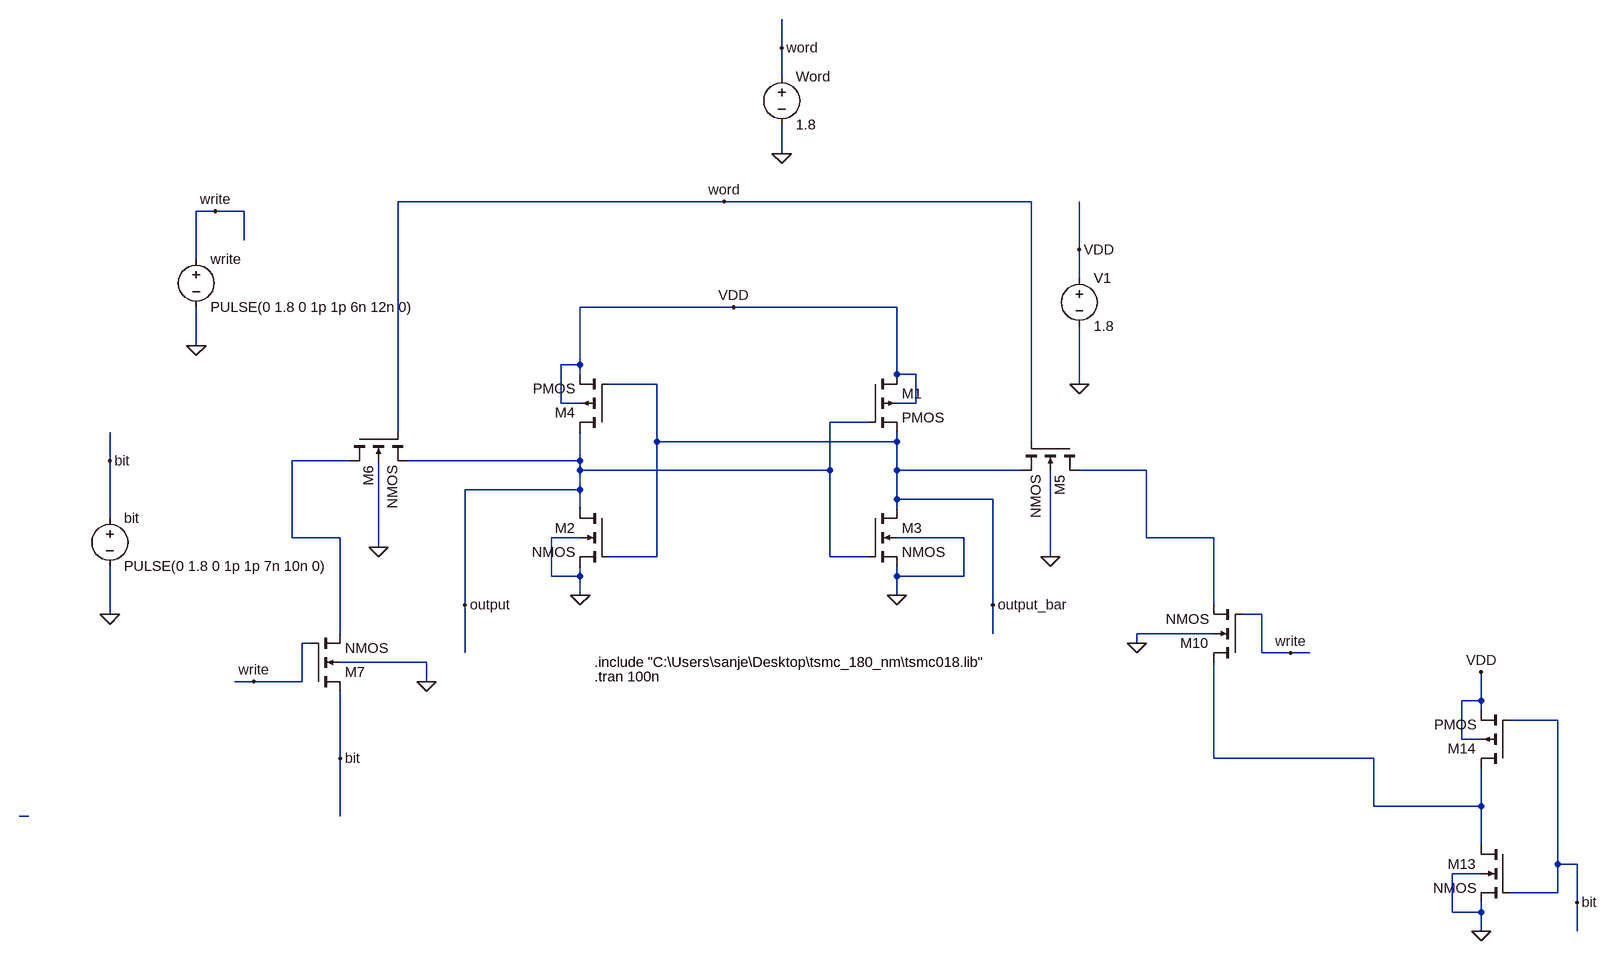
[diagram p0: schematic 6T -SRAM_write.asc]
6T -SRAM_write.asc, the LTspice schematic file:
Version 4.1
SHEET 1 1616 740
WIRE 144 -752 144 -800
WIRE 144 -704 144 -752
WIRE 144 -576 144 -624
WIRE 48 -496 -496 -496
WIRE 560 -496 48 -496
WIRE -800 -480 -832 -480
WIRE -752 -480 -800 -480
WIRE -752 -432 -752 -480
WIRE 640 -416 640 -496
WIRE -832 -400 -832 -480
WIRE 640 -368 640 -416
WIRE 64 -320 -192 -320
WIRE 336 -320 64 -320
WIRE -832 -256 -832 -320
WIRE -192 -224 -192 -320
WIRE -192 -224 -224 -224
WIRE -192 -208 -192 -224
WIRE 336 -208 336 -320
WIRE 368 -208 336 -208
WIRE -64 -192 -144 -192
WIRE 640 -192 640 -288
WIRE -224 -160 -224 -224
WIRE -192 -160 -224 -160
WIRE 368 -160 368 -208
WIRE 368 -160 336 -160
WIRE 288 -128 224 -128
WIRE -496 -112 -496 -496
WIRE -64 -96 -64 -192
WIRE 336 -96 336 -112
WIRE 336 -96 -64 -96
WIRE 560 -96 560 -496
WIRE -976 -64 -976 -112
WIRE -576 -64 -672 -64
WIRE -192 -64 -192 -112
WIRE -192 -64 -480 -64
WIRE -192 -48 -192 -64
WIRE 224 -48 224 -128
WIRE 224 -48 -192 -48
WIRE 336 -48 336 -96
WIRE 544 -48 336 -48
WIRE 752 -48 640 -48
WIRE -192 -16 -192 -48
WIRE -192 -16 -384 -16
WIRE 336 0 336 -48
WIRE 496 0 336 0
WIRE -192 16 -192 -16
WIRE 336 16 336 0
WIRE -976 32 -976 -64
WIRE -672 64 -672 -64
WIRE -592 64 -672 64
WIRE -192 64 -240 64
WIRE 448 64 336 64
WIRE 752 64 752 -48
WIRE 864 64 752 64
WIRE -528 80 -528 -64
WIRE -64 96 -64 -96
WIRE -64 96 -144 96
WIRE 224 96 224 -48
WIRE 288 96 224 96
WIRE 592 96 592 -48
WIRE -240 128 -240 64
WIRE -192 128 -192 112
WIRE -192 128 -240 128
WIRE 336 128 336 112
WIRE 448 128 448 64
WIRE 448 128 336 128
WIRE -192 160 -192 128
WIRE 336 160 336 128
WIRE -384 176 -384 -16
WIRE 496 176 496 0
WIRE 864 176 864 64
WIRE -976 192 -976 112
WIRE 944 192 912 192
WIRE -592 224 -592 64
WIRE 496 224 496 176
WIRE 864 224 736 224
WIRE -640 240 -656 240
WIRE 736 240 736 224
WIRE -384 256 -384 176
WIRE 944 256 944 192
WIRE 992 256 944 256
WIRE 1024 256 992 256
WIRE -448 272 -592 272
WIRE -736 304 -768 304
WIRE -656 304 -656 240
WIRE -656 304 -736 304
WIRE -448 304 -448 272
WIRE 1440 336 1440 288
WIRE 1440 336 1408 336
WIRE 1440 352 1440 336
WIRE 1568 368 1488 368
WIRE 1408 400 1408 336
WIRE 1440 400 1408 400
WIRE -592 432 -592 320
WIRE 864 432 864 272
WIRE 1168 432 864 432
WIRE 1168 512 1168 432
WIRE 1440 512 1440 448
WIRE 1440 512 1168 512
WIRE -1968 528 -1984 528
WIRE -592 528 -592 432
WIRE 1440 576 1440 512
WIRE 1568 608 1568 368
WIRE 1600 608 1568 608
WIRE 1440 624 1392 624
WIRE 1568 656 1568 608
WIRE 1568 656 1488 656
WIRE 1600 672 1600 608
WIRE 1392 688 1392 624
WIRE 1440 688 1440 672
WIRE 1440 688 1392 688
WIRE 1440 720 1440 688
WIRE 1600 720 1600 672
FLAG 336 160 0
FLAG -192 160 0
FLAG 64 -320 VDD
FLAG 640 -192 0
FLAG 640 -416 VDD
FLAG 48 -496 word
FLAG 144 -576 0
FLAG 144 -752 word
FLAG -528 80 0
FLAG 592 96 0
FLAG -832 -256 0
FLAG 736 240 0
FLAG -384 176 output
FLAG 496 176 output_bar
FLAG 1440 720 0
FLAG 1440 288 VDD
FLAG -800 -480 write
FLAG -976 192 0
FLAG 1600 672 bit
FLAG 992 256 write
FLAG -448 304 0
FLAG -592 432 bit
FLAG -736 304 write
FLAG -976 -64 bit
SYMBOL pmos4 288 -208 R0
SYMATTR InstName M1
SYMATTR Value2 l=0.18u w=0.2u
SYMBOL nmos4 288 16 R0
SYMATTR InstName M3
SYMATTR Value2 l=0.18u w=0.1u
SYMBOL nmos4 -144 16 M0
SYMATTR InstName M2
SYMATTR Value2 l=0.18u w=0.1u
SYMBOL pmos4 -144 -112 R180
SYMATTR InstName M4
SYMATTR Value2 l=0.18u w=0.2u
SYMBOL voltage 640 -384 R0
WINDOW 123 0 0 Left 0
WINDOW 39 0 0 Left 0
SYMATTR InstName V1
SYMATTR Value 1.8
SYMBOL nmos4 640 -96 R90
SYMATTR InstName M5
SYMATTR Value2 l=0.18u w=0.1u
SYMBOL nmos4 -576 -112 M90
SYMATTR InstName M6
SYMATTR Value2 l=0.18u w=0.6u
SYMBOL voltage 144 -720 R0
WINDOW 123 0 0 Left 0
WINDOW 39 0 0 Left 0
SYMATTR InstName Word
SYMATTR Value 1.8
SYMBOL voltage -832 -416 R0
WINDOW 123 0 0 Left 0
WINDOW 39 0 0 Left 0
SYMATTR InstName write
SYMATTR Value PULSE(0 1.8 0 1p 1p 6n 12n 0)
SYMBOL nmos4 1488 576 M0
SYMATTR InstName M13
SYMATTR Value2 l=0.18u w=0.5u
SYMBOL pmos4 1488 448 R180
SYMATTR InstName M14
SYMATTR Value2 l=0.15u w=1u
SYMBOL voltage -976 16 R0
WINDOW 123 0 0 Left 0
WINDOW 39 0 0 Left 0
SYMATTR InstName bit
SYMATTR Value PULSE(0 1.8 0 1p 1p 7n 10n 0)
SYMBOL nmos4 -640 320 M180
SYMATTR InstName M7
SYMATTR Value2 l=0.18u w=0.1u
SYMBOL nmos4 912 272 R180
SYMATTR InstName M10
SYMATTR Value2 l=0.18u w=0.2u
TEXT -168 272 Left 2 !.include "C:\\Users\\sanje\\Desktop\\tsmc_180_nm\\tsmc018.lib"
TEXT -168 296 Left 2 !.tran 100n

The netlist it stands for:
* 6T -SRAM_write.asc
M1 VDD output output_bar VDD PMOS l=0.18u w=0.2u
M3 output_bar output 0 0 NMOS l=0.18u w=0.1u
M2 output output_bar 0 0 NMOS l=0.18u w=0.1u
M4 output output_bar VDD VDD PMOS l=0.18u w=0.2u
V1 VDD 0 1.8
M5 N002 word output_bar 0 NMOS l=0.18u w=0.1u
M6 N001 word output 0 NMOS l=0.18u w=0.6u
V§Word word 0 1.8
V§write write 0 PULSE(0 1.8 0 1p 1p 6n 12n 0)
M13 N003 bit 0 0 NMOS l=0.18u w=0.5u
M14 N003 bit VDD VDD PMOS l=0.15u w=1u
V§bit bit 0 PULSE(0 1.8 0 1p 1p 7n 10n 0)
M7 bit write N001 0 NMOS l=0.18u w=0.1u
M10 N003 write N002 0 NMOS l=0.18u w=0.2u
.model NMOS NMOS
.model PMOS PMOS
.lib standard.mos
.include "C:\Users\sanje\Desktop\tsmc_180_nm\tsmc018.lib"
.tran 100n
.backanno
.end